# EAGLE design ESP32 led flasher 3 (EAGLE 8.5.1)
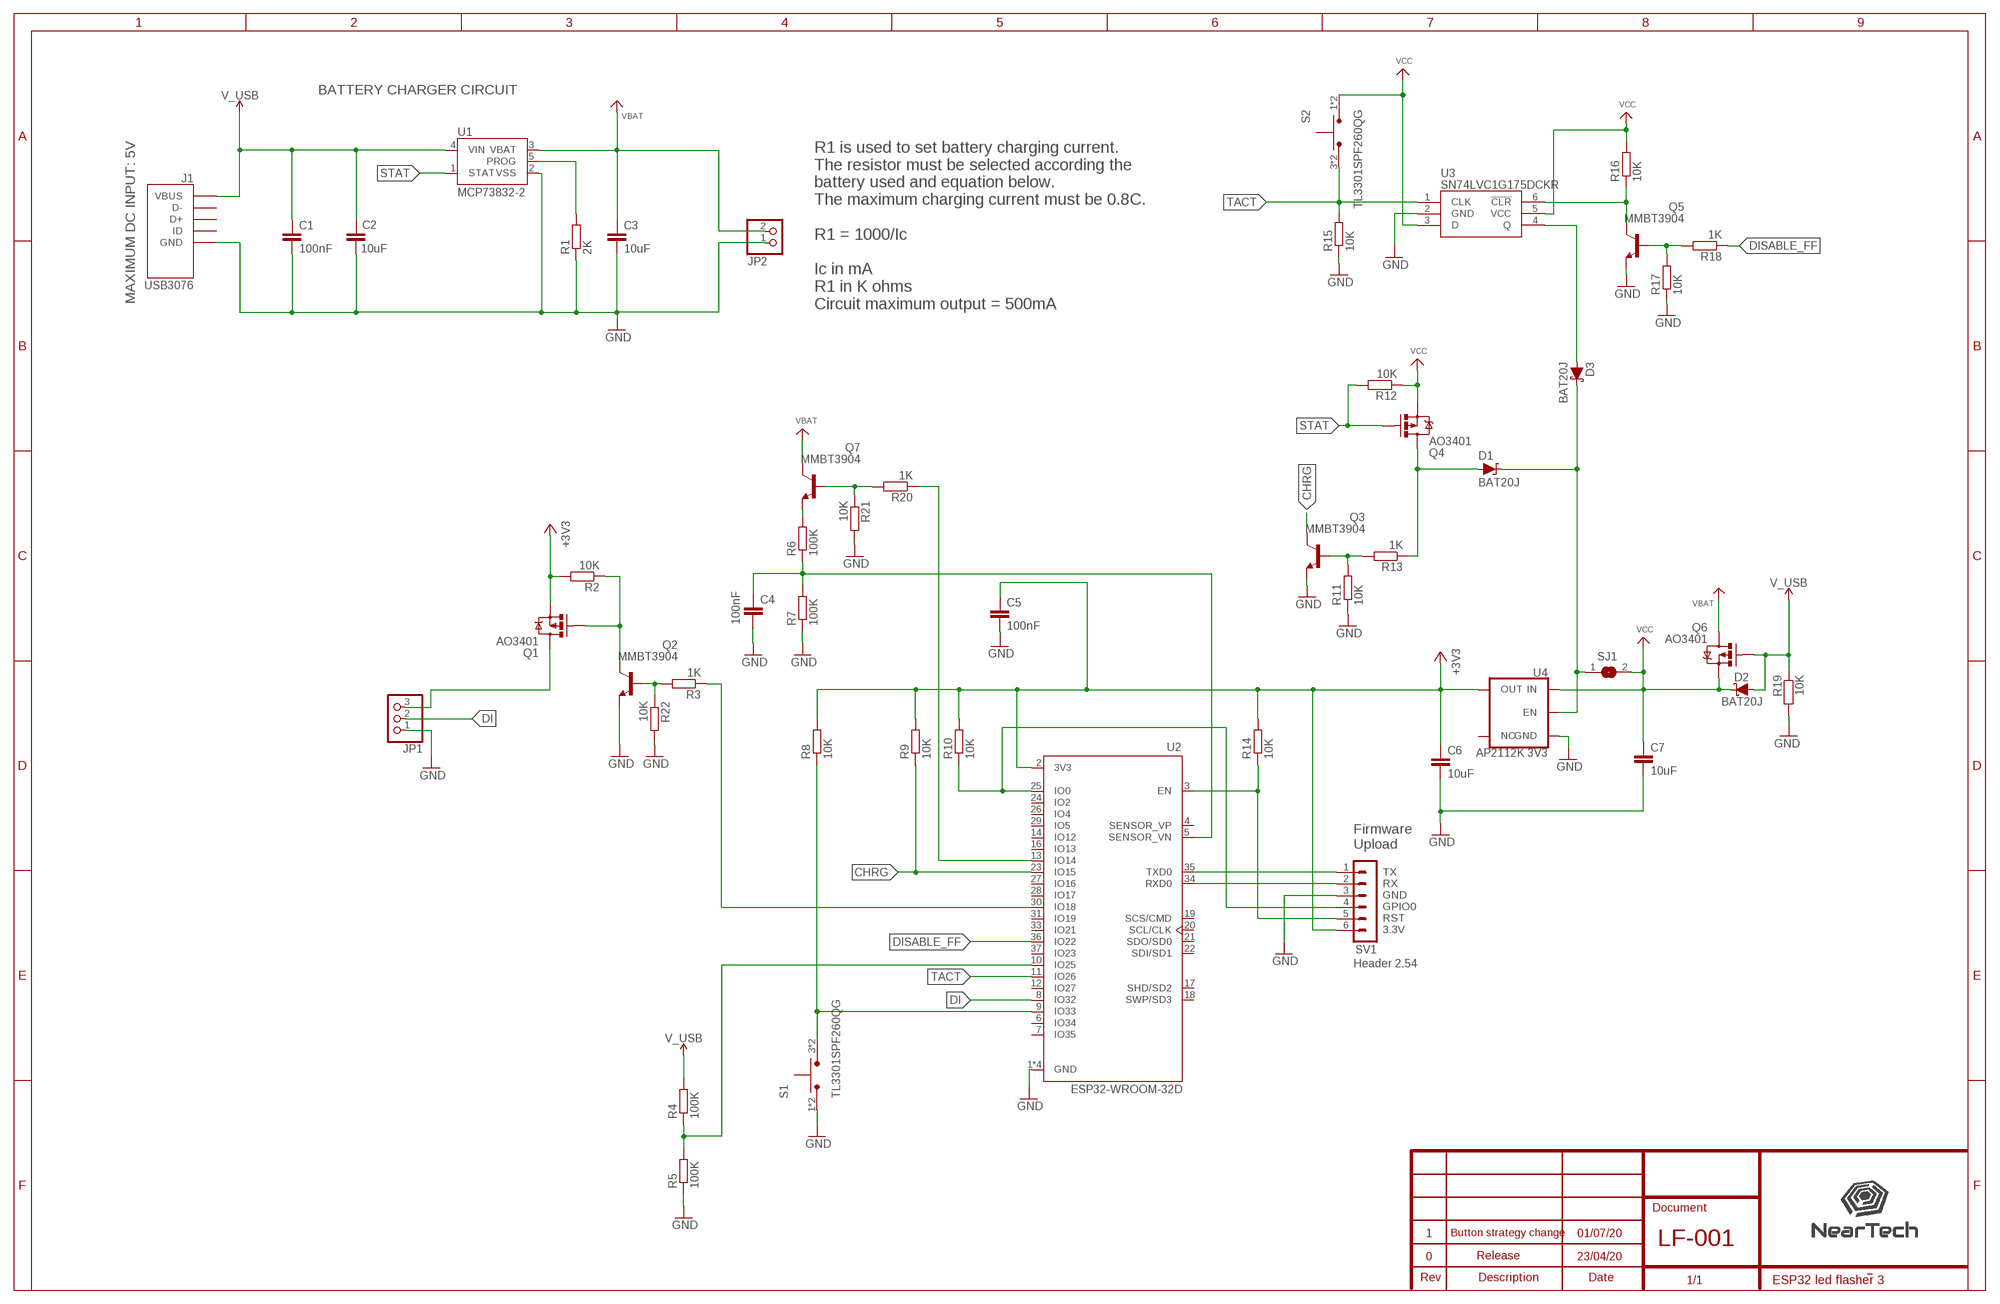
[diagram p0: schematic, sheet 1]

## Parts
C1  100nF  C-EUC0402  [C0402]
C2  10uF  C-EUC0603  [C0603]
C3  10uF  C-EUC0603  [C0603]
C4  100nF  C-EUC0402  [C0402]
C5  100nF  C-EUC0402  [C0402]
C6  10uF  C-EUC0603  [C0603]
C7  10uF  C-EUC0603  [C0603]
D1  BAT20J  DIODE-SCHOTTKY-BAT20J  [SOD-323]
D2  BAT20J  DIODE-SCHOTTKY-BAT20J  [SOD-323]
D3  BAT20J  DIODE-SCHOTTKY-BAT20J  [SOD-323]
J1  USB3076  USB3076-XX-X_REVC  [GCT_USB3076-XX-X_REVC]
JP1  PINHD-1X3_2.54  [1X03]
JP2  PINHD-1X2_2.54  [1X02]
Q1  AO3401  MOSFET-PCHANNELDMG2307L  [SOT23-3@1]
Q2  MMBT3904  BCX70SMD  [SOT23]
Q3  MMBT3904  BCX70SMD  [SOT23]
Q4  AO3401  MOSFET-PCHANNELDMG2307L  [SOT23-3@1]
Q5  MMBT3904  BCX70SMD  [SOT23]
Q6  AO3401  MOSFET-PCHANNELDMG2307L  [SOT23-3@1]
Q7  MMBT3904  BCX70SMD  [SOT23]
R1  2K  R-EU_R0603  [R0603]
R2  10K  R-EU_R0603  [R0603]
R3  1K  R-EU_R0603  [R0603]
R4  100K  R-EU_R0603  [R0603]
R5  100K  R-EU_R0603  [R0603]
R6  100K  R-EU_R0603  [R0603]
R7  100K  R-EU_R0603  [R0603]
R8  10K  R-EU_R0603  [R0603]
R9  10K  R-EU_R0603  [R0603]
R10  10K  R-EU_R0603  [R0603]
R11  10K  R-EU_R0603  [R0603]
R12  10K  R-EU_R0603  [R0603]
R13  1K  R-EU_R0603  [R0603]
R14  10K  R-EU_R0603  [R0603]
R15  10K  R-EU_R0603  [R0603]
R16  10K  R-EU_R0603  [R0603]
R17  10K  R-EU_R0603  [R0603]
R18  1K  R-EU_R0603  [R0603]
R19  10K  R-EU_R0603  [R0603]
R20  1K  R-EU_R0603  [R0603]
R21  10K  R-EU_R0603  [R0603]
R22  10K  R-EU_R0603  [R0603]
S1  TL3301SPF260QG  [SW_TL3301SPF260QG]
S2  TL3301SPF260QG  [SW_TL3301SPF260QG]
SJ1  SOLDERJUMPERREFLOW  [SOLDERJUMPER_REFLOW]
SV1  Header 2.54  MA06-1  [MA06-1]
U1  MCP73832-2  MCP73831  [SOT23-5]
U2  ESP32-WROOM-32D  [MODULE_ESP32-WROOM-32D]
U3  SN74LVC1G175DCKR  [SOP65P210X110-6N]
U4  AP2112K 3V3  V_REG_AP2112K-3.3V  [SOT23-5]

## Nets
!CLR: Q5.3(C) R16.1 U3.6(!CLR)
+3V3: C5.1 C6.1 Q1.2(S) R2.2 R8.2 R9.2 R10.2 R14.2 SV1.6 U2.2(3V3) U4.5(OUT)
CHRG: Q3.3(C) R9.1 U2.23(IO15)
DI: JP1.2 U2.8(IO32)
DISABLE_FF: R18.1 U2.36(IO22)
GND: C1.2 C2.2 C3.2 C4.2 C5.2 C6.2 C7.2 J1.5(GND) JP1.1 JP2.1 Q2.2(E) Q3.2(E) Q5.2(E) R1.1 R5.1 R7.1 R11.1 R15.1 R17.1 R19.2 R21.2 R22.2 S1.1 S1.2 SV1.3 U1.2(VSS) U2.1(GND) U2.15(GND) U2.38(GND) U2.39(GND) U3.2(GND) U4.2(GND)
N$1: D1.A Q4.3(D) R13.1
N$2: Q7.1(B) R20.2 R21.1
N$3: Q3.1(B) R11.2 R13.2
N$4: Q5.1(B) R17.2 R18.2
N$5: Q1.1(G) Q2.3(C) R2.1
N$6: C4.1 R6.1 R7.2 U2.5(SENSOR_VN)
N$8: Q7.2(E) R6.2
N$9: R10.1 SV1.4 U2.25(IO0)
N$10: R14.1 SV1.5 U2.3(EN)
N$11: R1.2 U1.5(PROG)
N$12: SV1.1 U2.35(TXD0)
N$13: SV1.2 U2.34(RXD0)
N$14: R20.1 U2.13(IO14)
N$15: D3.A U3.4(Q)
N$16: Q2.1(B) R3.2 R22.1
N$19: D1.C D3.C SJ1.1 U4.3(EN)
N$21: R8.1 S1.3 S1.4 U2.9(IO33)
N$25: R3.1 U2.30(IO18)
N$26: JP1.3 Q1.3(D)
N$29: R4.1 R5.2 U2.10(IO25)
STAT: Q4.1(G) R12.2 U1.1(STAT)
TACT: R15.2 S2.3 S2.4 U2.11(IO26) U3.1(CLK)
V_USB: C1.1 C2.1 D2.A J1.1(VBUS) Q6.1(G) R4.2 R19.1 U1.4(VIN)
VBAT: C3.1 JP2.2 Q6.3(D) Q7.3(C) U1.3(VBAT)
VCC: C7.1 D2.C Q4.2(S) Q6.2(S) R12.1 R16.2 S2.1 S2.2 SJ1.2 U3.3(D) U3.5(VCC) U4.1(IN)
Unconnected: J1.2(D-) J1.3(D+) J1.4(ID) U2.4(SENSOR_VP) U2.6(IO34) U2.7(IO35) U2.12(IO27) U2.14(IO12) U2.16(IO13) U2.17(SHD/SD2) U2.18(SWP/SD3) U2.19(SCS/CMD) U2.20(SCL/CLK) U2.21(SDO/SD0) U2.22(SDI/SD1) U2.24(IO2) U2.26(IO4) U2.27(IO16) U2.28(IO17) U2.29(IO5) U2.31(IO19) U2.33(IO21) U2.37(IO23) U4.4(NC)

## Notes on the sheet
- BATTERY CHARGER CIRCUIT
- MAXIMUM DC INPUT: 5V
- R1 is used to set battery charging current.
  The resistor must be selected according the 
  battery used and equation below. 
  The maximum charging current must be 0.8C.
  
  R1 = 1000/Ic
  
  Ic in mA
  R1 in K ohms
  Circuit maximum output = 500mA
- Firmware
  Upload
- TX
  RX
  GND
  GPIO0
  RST
  3.3V
- 1 | Button strategy change | 01/07/20
- LF-001
- 0 | Release | 23/04/20

## Library data of the parts
C1 C3-C5 C7 = rcl:C-EU: CAPACITOR, European symbol; SPICEPREFIX: C
C2 C6 = rcl:C-EU: CAPACITOR, European symbol
D1-D3 = SparkFun-DiscreteSemi:DIODE-SCHOTTKY: Schottky diode A Schottky diode is a semiconductor diode which has a low forward voltage drop and a very fast switching action.; PROD_ID: DIO-11623; VALUE: 1A/23V/620mV
J1 = USB3076-XX-X_REVC:USB3076-XX-X_REVC: Micro USB Receptacle, Type B, SMT, Horizontal, Bottom Mount w/out Peg, w/out Shell Stakes, w/out Mating Face Lead-In; AVAILABILITY: Good; DESCRIPTION: USB Series Horizontal Micro USB B Type Bottom Surface Mount Connector; MF: Global Connector Technology; MP: USB3076-30-A; PACKAGE: None; PRICE: 0.38 USD
JP1 = con-pinhead:PINHD-1X3: PIN HEADER
JP2 = con-pinhead:PINHD-1X2: PIN HEADER
Q1 Q4 Q6 = SparkFun-DiscreteSemi:MOSFET-PCHANNEL: Generic PMOSFET IRLML2244 - TRANS-11153 (SOT-23 -20V -4.3A) (1.Gate 2.Source 3.Drain) FQP27P06 - COM-10349 <http://www.sparkfun.com/products/10349> (TO-220 -60V -27A) (1.Gate 2.Source 3.Drain); PROD_ID: TRANS-11308; VALUE: 2.5A/30V
Q2 Q3 Q5 Q7 = transistor:BCX70SMD: NPN TRANSISTOR
R1-R22 = rcl:R-EU_: RESISTOR, European symbol; SPICEPREFIX: R
S1 S2 = TL3301SPF260QG:TL3301SPF260QG: TL3301 Series SPST 2.6 N Round Button Gull Wing Surface Mount Tactile Switch; AVAILABILITY: Unavailable; DESCRIPTION: Tactile Switch SPST-NO Top Actuated Surface Mount; MF: E-Switch; MP: TL3301SPF260QG; PACKAGE: SOT-23 E-Switch; PRICE: None
SJ1 = microbuilder:SOLDERJUMPER: SMD Solder JUMPER Solder the two pads together to create a connection, or remove the solder to break it. REFLOW - Use this footprint for solder paste and reflow ovens. WAVE - Use this footprint for hand-soldering (larger pads). CLOSED - Has a trace between the two pads to ensure it is closed by default. The trace needs to be cut to disable the jumper, and can be closed again by creating a solder bridge between the two pads.
SV1 = con-lstb:MA06-1: PIN HEADER; OC_FARNELL: unknown; OC_NEWARK: unknown
U1 = SparkFun-PowerIC:MCP73831: Miniature single cell, fully integrated Li-Ion, Li-polymer charge management controller http://ww1.microchip.com/downloads/en/DeviceDoc/21984a.pdf IC-09995; PROD_ID: IC-09995
U2 = ESP32-WROOM-32D:ESP32-WROOM-32D: IC: SoC; GPIO, I2C, I2S, IR, SD, SDIO, SPI, UART; 2.7÷3.6VDC; 20dBm; AVAILABILITY: Unavailable; DESCRIPTION: IC: SoC; GPIO, I2C, I2S, IR, SD, SDIO, SPI, UART; 2.7÷3.6VDC; 20dBm; MF: Espressif Systems; MP: ESP32-WROOM-32D; PACKAGE: Module Espressif Systems; PRICE: None
U3 = SN74LVC1G175DCKR:SN74LVC1G175DCKR: Single D-Type Flip-Flop with Asynchronous Clear Source: Datasheet <http://www.ti.com/lit/gpn/sn74lvc1g175>; DESCRIPTION: Single D-Type Flip-Flop with Asynchronous Clear; HEIGHT: 1.1mm; MANUFACTURER_NAME: Texas Instruments; MANUFACTURER_PART_NUMBER: SN74LVC1G175DCKR; MOUSER_PART_NUMBER: 595-SN74LVC1G175DCKR; MOUSER_PRICE-STOCK: https://www.mouser.com/Search/Refine.aspx?Keyword=595-SN74LVC1G175DCKR; RS_PART_NUMBER: 595-SN74LVC1G175DCKR; RS_PRICE-STOCK: https://www.mouser.com/Search/Refine.aspx?Keyword=595-SN74LVC1G175DCKR
U4 = SparkFun-IC-Power:V_REG_AP2112: AP2112 - 600mA CMOS LDO Regulator w/ Enable The AP2112 is CMOS process low dropout linear regulator with enable function, the regulator delivers a guaranteed 600mA (min.) continuous load current. Features Output Voltage Accuracy: ±1.5% Output Current: 600mA (Min.) Foldback Short Current Protection: 50mA Enable Function to Turn ON/OFF VOUT Low Dropout Voltage (3.3V): 250mV (Typ.) @IOUT=600mA Excellent Load Regulation: 0.2%/A (Typ.) Excellent Line Regulation: 0.02%/V (Typ.) Low Quiescent Current: 55μA (Typ.) Low Standby Current: 0.01μA (Typ.) Low Output Noise: 50μVRMS PSRR: 100Hz -65dB, 1kHz -65dB OTSD Protection Stable with 1.0μF Flexible Cap: Ceramic, Tantalum and Aluminum Electrolytic Operation Temperature Range: -40°C to 85°C ESD: MM 400V, HBM 4000V; PROD_ID: VREG-12457; VALUE: 3.3V

## Net classes
0 default: width 0 mm, drill 0 mm
1 vcc: width 0 mm

## Board
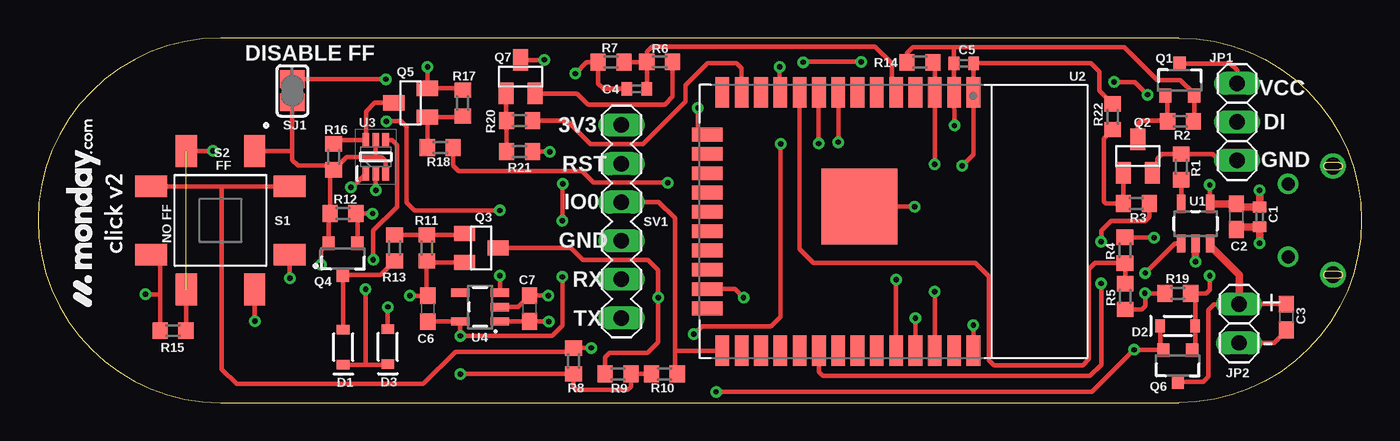
[diagram p1: board, top side]
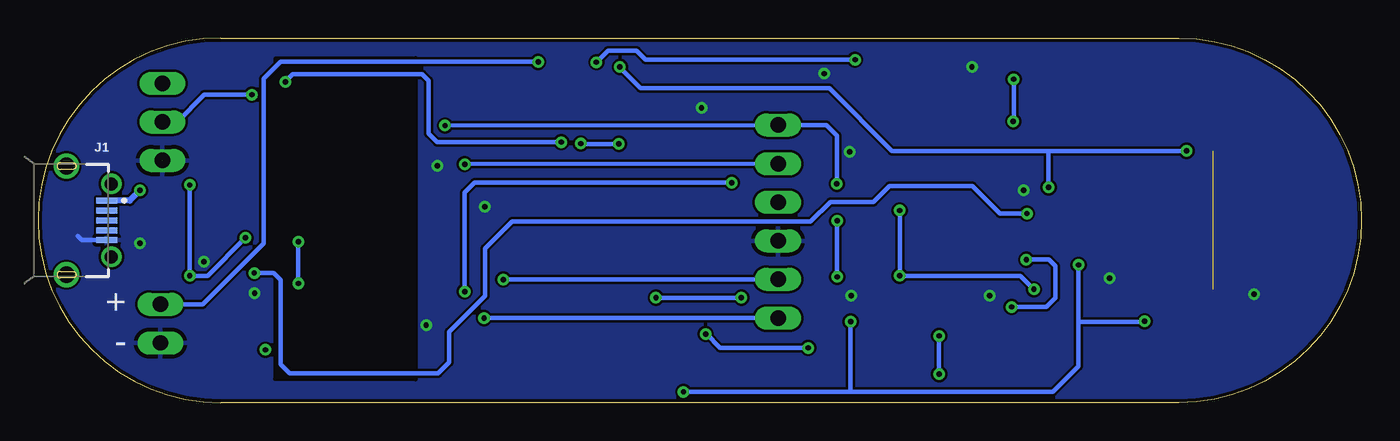
[diagram p2: board, bottom side, seen from below]

Size 87.03 x 24 mm. Coordinates in mm from the lower left corner, seen from the top.
Outline: 12,0 75,0 arc180 75,24 12,24 arc180 12,0
Copper layers (1*16): Top 0.035mm / dielectric 1.5mm / Bottom 0.035mm
Design rules "default *": minimum track width 6mil, minimum drill 0.35mm, track to track 6mil, track to pad 6mil, pad to pad 6mil, via to via 6mil, smd to smd 6mil, copper to edge 10mil, drill to drill 6mil, minimum pad ring 10mil, minimum via ring 8mil, stop-mask expansion 4mil, vias tented up to drill 15mil, thermal gap 10mil

### Footprints (pad centres in the part's own frame; a part is rotated, then mirrored left to right if it is on the bottom)
C0402 = smd 0.7 x 0.9: 1 -0.65,0; 2 0.65,0
C0603 = smd 1.1 x 1: 1 -0.85,0; 2 0.85,0
SOD-323 = smd 0.63 x 0.83: A 1.15,0; C -1.15,0
GCT_USB3076-XX-X_REVC = smd 0.4 x 1.4: 1 -1.3,2.65; 2 -0.65,2.65; 3 0,2.65; 4 0.66,2.65; 5 1.3,2.65 | drill 1.1: P$1 -3.575,0; P$2 3.575,0 | drill 0.85: P$3 -2.4,2.95; P$4 2.4,2.95
1X03 = drill 1.016 long: 1 -2.54,0; 2 0,0; 3 2.54,0
1X02 = drill 1.016 long: 1 -1.27,0; 2 1.27,0
SOT23-3@1 = smd 0.8 x 0.9: 1 -0.95,-1; 2 0.95,-1; 3 0,1.1
SOT23 = smd 1 x 1.4: 1 -0.95,-1.1; 2 0.95,-1.1; 3 0,1.1
R0603 = smd 1 x 1.1: 1 -0.85,0; 2 0.85,0
SW_TL3301SPF260QG = smd 2.1 x 1.4: 1 -4.55,2.25; 2 4.55,2.25; 3 -4.55,-2.25; 4 4.55,-2.25
SOLDERJUMPER_REFLOW = smd 1.168 x 1.6: 1 -0.762,0; 2 0.762,0
MA06-1 = drill 1.016 long: 1 -6.35,0; 2 -3.81,0; 3 -1.27,0; 4 1.27,0; 5 3.81,0; 6 6.35,0
SOT23-5 = smd 0.55 x 1.2: 1 -0.95,-1.3; 2 0,-1.3; 3 0.95,-1.3; 4 0.95,1.3; 5 -0.95,1.3
MODULE_ESP32-WROOM-32D = smd 2 x 0.9: 1 -8.5,5.26; 2 -8.5,3.99; 3 -8.5,2.72; 4 -8.5,1.45; 5 -8.5,0.18; 6 -8.5,-1.09; 7 -8.5,-2.36; 8 -8.5,-3.63; 9 -8.5,-4.9; 10 -8.5,-6.17; 11 -8.5,-7.44; 12 -8.5,-8.71; 13 -8.5,-9.98; 14 -8.5,-11.25; 25 8.5,-11.25; 26 8.5,-9.98; 27 8.5,-8.71; 28 8.5,-7.44; 29 8.5,-6.17; 30 8.5,-4.9; 31 8.5,-3.63; 32 8.5,-2.36; 33 8.5,-1.09; 34 8.5,0.18; 35 8.5,1.45; 36 8.5,2.72; 37 8.5,3.99; 38 8.5,5.26 | smd 0.9 x 2: 15 -5.715,-12.25; 16 -4.445,-12.25; 17 -3.175,-12.25; 18 -1.905,-12.25; 19 -0.635,-12.25; 20 0.635,-12.25; 21 1.905,-12.25; 22 3.175,-12.25; 23 4.445,-12.25; 24 5.715,-12.25 | smd 5 x 5: 39 -1,-2.24
SOP65P210X110-6N = smd 0.95 x 0.45: 1 -1.1,0.65; 2 -1.1,0; 3 -1.1,-0.65; 4 1.1,-0.65; 5 1.1,0; 6 1.1,0.65

### Placement (x,y rotation side)
C1  80.33,12.23 270 top
C2  78.79,12.24 270 top
C3  82.08,5.64 270 top
C4  39.37,20.65 180 top
C5  60.88,22.33 0 top
C6  25.64,6.19 90 top
C7  32.32,6.2 90 top
D1  20.06,3.66 90 top
D2  74.94,5.05 0 top
D3  23,3.68 90 top
J1  85.15,12 270 bottom
JP1  78.85,18.48 90 top
JP2  78.98,5.21 90 top
Q1  75.07,21.21 0 top
Q2  72.33,16.23 0 top
Q3  29.14,10.19 270 top
Q4  20.05,9.5 180 top
Q5  24.5,19.74 90 top
Q6  74.94,2.46 180 top
Q7  31.74,21.45 0 top
R1  75.17,15.52 270 top
R2  75.12,18.52 0 top
R3  72.22,13.11 180 top
R4  71.46,10.03 90 top
R5  71.49,6.99 90 top
R6  40.88,22.43 0 top
R7  37.68,22.4 0 top
R8  35.22,2.74 270 top
R9  38.14,1.91 0 top
R10  41.18,1.91 180 top
R11  25.56,10.19 90 top
R12  20.05,12.45 0 top
R13  23.46,10.19 90 top
R14  57.99,22.4 180 top
R15  8.88,4.74 0 top
R16  19.44,16.18 270 top
R17  27.93,19.71 270 top
R18  26.45,16.79 180 top
R19  74.94,7.19 180 top
R20  31.66,18.56 180 top
R21  31.66,16.52 0 top
R22  70.66,18.81 90 top
S1  12,11.99 180 top
S2  12,12 270 top
SJ1  16.72,20.52 270 top
SV1  38.37,11.92 90 top
U1  76.11,11.79 0 top
U2  56.25,11.92 270 top
U3  22.21,16.18 90 top
U4  29.07,6.3 90 top

### Tracks (layer width: path | path; a pad name or v marks a point on that pad's centre or on a via)
!CLR
  Top 0.305: Q5.3 22.13,19.74 21.56,19.16 U3.6 19.69,17.28 R16.1
+3V3  (via drill 0.35)
  Top 0.305: v60.26,18.24 U2.2 60.23,20.43 C5.1 60.23,23.34 60.28,23.39 | 60.28,23.39 71.44,23.39 73.59,21.23 75.12,21.23 76.02,20.34 Q1.2 76.02,18.57 R2.2 | R10.2 R9.2 38.99,1.05 38.77,0.84 35.42,0.84 35.22,1.04 R8.2 27.79,1.89 v27.77,1.88 | C6.1 27.76,5.34 | 27.76,5.34 U4.5 | 27.76,5.34 27.76,4.41 v27.77,4.39 33.79,4.39 34.48,5.08 v34.48,8.28 | v34.48,11.96 v34.5,14.4 | 60.28,23.39 57.52,23.39 57.14,23.02 R14.2
  Bottom 0.305: SV1.6 38.75,18.27 | 38.75,18.27 v60.26,18.24 | v27.77,1.88 v27.77,4.39 | v34.48,8.28 v34.48,11.96 | v34.5,14.4 34.48,17.58 35.17,18.27 38.75,18.27
CHRG  (via drill 0.35)
  Top 0.305: v46.39,6.91 45.82,7.48 U2.23 | Q3.3 35.06,10.19 35.85,9.4 40.12,9.4 40.78,8.74 v40.78,6.91 40.78,3.96 40.09,3.28 37.58,3.28 37.29,2.98 R9.1
  Bottom 0.305: v40.78,6.91 v46.39,6.91
DI  (via drill 0.35)
  Top 0.305: U2.8 v52.62,17.15 v52.62,17.14 | v72.96,20.27 72.12,21.11 v70.77,21.11
  Bottom 0.305: v52.62,17.14 60.79,17.14 61.35,17.7 61.35,21.18 61.78,21.61 70.27,21.61 70.85,21.03 v70.77,21.11 | v72.96,20.27 76.08,20.27 77.88,18.48 JP1.2
DISABLE_FF  (via drill 0.35)
  Top 0.305: U2.36 v58.97,7.31 v58.97,7.32 | v41.41,14.48 36.54,14.48 35.76,15.26 27.66,15.26 27.3,15.61 R18.1
  Bottom 0.305: v58.97,7.32 58.97,13.84 58.33,14.48 v41.41,14.48
GND  (via drill 0.35)  (1 unrouted)
  Top 0.305: JP2.1 81.29,3.94 82.08,4.72 C3.2 | 78.97,11.58 C2.2 | U2.38 v61.51,5.1 v61.51,5.11 | R19.2 72.81,7.19 | 72.81,7.19 v72.78,7.21 | Q2.2 73.28,15.48 73.44,15.65 73.59,15.65 73.59,16.05 73.9,16.36 75.16,16.36 R1.1 77.27,16.37 77.7,15.94 JP1.1 | U4.2 31.56,6.3 32.31,7.05 C7.2 v33.55,7.05 v33.56,7.04 | C6.2 25.59,7.04 | 25.59,7.04 v24.45,7.04 | Q3.2 25.66,9.23 R11.1 25.56,7.06 25.59,7.04 | C4.2 37.17,20.65 36.83,20.99 R7.1 36.08,22.4 v35.34,21.66 | U2.39 57.62,12.92 v57.64,12.9 | R17.1 27.8,20.69 Q5.2 25.61,20.7 v25.61,22.1 | U3.2 v22.21,13.97 | R5.1 72.57,6.13 72.81,6.38 72.81,7.19 | U2.15 43.86,17.78 43.39,17.78 v43.39,19.41 | v60.77,15.6 61.51,16.33 U2.1 61.51,22.3 C5.2 69.23,22.33 69.78,21.77 69.78,20.54 R22.2 | 8.03,7.13 8.03,9.16 S1.2 | 8.03,7.13 R15.1 | S1.1 16.55,8.21 v16.57,8.19 | 8.03,7.13 v7.06,7.13 | R21.2 33.63,16.52 v33.65,16.5
  Top 0.508: 78.97,11.58 C1.2 v80.33,10.49 | U1.2 v76.11,9.27
  Bottom 0.305: 84.42,10.97 84.14,10.7 J1.5 | v22.21,13.97 22.24,13.99 | v25.61,22.1 25.61,22.07 | v7.06,7.13 v7.06,7.14
  pour Bottom: -1.69,-1.73 88.53,-1.73 88.63,-1.63 88.63,24.05 88.78,24.21 -1.67,24.21 -1.69,24.23
N$1
  Top 0.305: R13.1 22.52,8.4 Q4.3 D1.A
N$2
  Top 0.305: Q7.1 30.79,18.59 R20.2 R21.1
N$3
  Top 0.305: R13.2 R11.2 27.95,11.04 Q3.1
N$4
  Top 0.305: R18.2 Q5.1 27.85,18.79 R17.2
N$5
  Top 0.305: R2.1 74.27,18.54 | 74.27,18.54 74.27,20.06 Q1.1 | Q2.3 72.33,18.36 72.53,18.57 74.24,18.57 74.27,18.54
N$6
  Top 0.305: C4.1 R6.1 | R6.1 40,22.4 R7.2 | R6.1 40.03,23.08 40.38,23.44 55.04,23.44 56.13,22.34 56.13,20.72 U2.5
N$7
  cutout Bottom (rank 2, no thermals): 71.39,22.63 71.41,22.61 71.41,1.6 71.44,1.57 62.22,1.57 62.19,1.55 62.19,22.66
N$8
  Top 0.305: Q7.2 35.43,20.35 36.16,19.63 41.22,19.63 41.73,20.14 R6.2
N$9
  Top 0.305: SV1.4 40.8,13.21 41.87,12.14 41.87,3.38 | 41.87,3.38 41.87,2.07 R10.1 | U2.25 41.92,3.42 41.87,3.38
N$10  (via drill 0.35)
  Top 0.305: v58.97,15.7 U2.3 58.97,22.21 R14.1
  Bottom 0.305: SV1.5 v58.97,15.7
N$11
  Top 0.305: U1.5 R1.2
N$12  (via drill 0.35)
  Top 0.305: v57.7,5.56 U2.35
  Bottom 0.305: SV1.1 57.68,5.57 v57.7,5.56
N$13  (via drill 0.35)
  Top 0.305: v56.42,8.1 U2.34
  Bottom 0.305: SV1.2 56.41,8.11 v56.42,8.1
N$14
  Top 0.305: R20.1 34.8,18.56 36.35,17.02 39.77,17.02 42.57,19.81 42.57,20.91 44.02,22.36 45.94,22.36 46.27,22.03 U2.13
N$15  (via drill 0.35)
  Top 0.305: U3.4 23.29,17.28 23.61,16.96 23.61,12.89 22.04,11.32 v22.04,9.41 | v23,6.3 D3.A
  Bottom 0.305: v23,6.3 20.72,6.3 20.14,6.88 20.14,9.01 20.54,9.41 v22.04,9.41
N$16
  Top 0.305: Q2.1 R3.2 | R3.2 | R22.1 70.09,17.39 70.09,13.25 70.23,13.11 R3.2
N$19  (via drill 0.35)
  Top 0.305: SJ1.1 v22.87,21.29 | v30.36,12.65 24.75,12.65 24.24,13.16 24.24,18.16 23.89,18.52 v22.9,18.52 | v30.36,8.36 v30.37,8.35 U4.3 | D1.C 21.54,2.51 | 21.54,2.51 22.98,2.51 D3.C | 21.54,2.51 v21.54,7.46
  Bottom 0.305: v22.87,21.29 22.87,18.54 v22.9,18.52 | v30.36,12.65 v30.36,8.36 22.44,8.36 v21.54,7.46
N$21  (via drill 0.35)
  Top 0.305: v36.38,3.61 35.23,3.61 R8.1 34.98,3.36 27.46,3.36 25.33,1.23 13.06,1.23 12.08,2.21 12.08,14.24 | S1.3 12.08,14.24 | 12.08,14.24 S1.4 | v43.13,4.52 43.65,5.04 48.21,5.04 48.83,5.65 v48.83,17.03 | v51.33,17.05 51.33,20.41 U2.9
  Bottom 0.305: v36.38,3.61 42.17,3.61 43.08,4.52 v43.13,4.52 | v48.83,17.03 51.31,17.03 v51.33,17.05
N$25  (via drill 0.35)
  Top 0.305: U2.30 51.35,2.04 51.63,1.75 69.18,1.75 69.91,2.48 v69.91,7.85 | R3.1 73.07,12.23 72.81,11.96 70.55,11.96 69.91,11.33 v69.91,10.59
  Bottom 0.305: v69.91,10.59 v69.91,7.85
N$26
  Top 0.305: Q1.3 78.41,22.31 78.85,21.87 JP1.3
N$29
  Top 0.305: R5.2 71.49,9.16 R4.1 69.49,9.18 69.1,8.79 69.1,2.87 68.69,2.46 62.85,2.46 62.52,2.79 62.52,8.31 61.64,9.18 51,9.18 50.08,10.11 U2.10
STAT  (via drill 0.35)
  Top 0.305: Q4.1 21,12.35 R12.2 v22,12.45 | v72.81,8.53 74.76,10.49 U1.1
  Bottom 0.305: v22,12.45 23.77,12.45 25.57,14.25 31.04,14.25 32.08,13.21 34.93,13.21 36.23,11.91 55.87,11.91 57.64,10.13 57.64,7.01 60.01,4.65 60.01,2.64 60.72,1.93 70.46,1.93 71.07,2.54 71.07,8.08 71.53,8.53 v72.81,8.53
TACT  (via drill 0.35)  (1 unrouted)
  Top 0.305: S2.4 9.75,4.76 R15.2 | S2.3 11.48,16.55 v11.51,16.57 | v48.77,22.1 48.77,20.46 U2.11 | U3.1 20.65,14.17 v20.57,14.17
  Bottom 0.305: v11.51,16.57 20.57,16.57 | 20.57,16.57 30.86,16.57 34.97,20.69 47.4,20.69 48.77,22.06 v48.77,22.1 | v20.57,14.17 20.57,16.57
V_USB  (via drill 0.35)
  Top 0.305: C2.1 79,12.88 | Q6.1 76.09,3.66 D2.A 76.09,6.89 R19.1 76.82,7.19 77.05,7.42 v77.05,8.36 | U1.4 77.06,14.31 v77.05,14.33 | R4.2 73.35,10.88 v73.39,10.85
  Top 0.508: U1.4 C2.1 | 79,12.88 C1.1 v80.33,13.97
  Bottom 0.305: v77.05,14.33 v77.05,8.36 75.88,8.36 v73.39,10.85
  Bottom 0.406: v80.33,13.97 81,13.3 J1.1
VBAT  (via drill 0.35)
  Top 0.305: C3.1 78.99,6.49 JP2.2 77.3,6.48 76.95,6.12 76.95,1.7 76.61,1.36 Q6.3 | 77.28,10.03 77.06,10.25 U1.3 | Q7.3 33.28,22.55 v33.3,22.57 | v54.14,22.43 50.33,22.43 v50.31,22.4
  Top 0.508: JP2.2 78.98,8.41 77.14,10.25 77.06,10.25
  Bottom 0.305: v54.14,22.43 71.06,22.43 72.17,21.31 72.17,10.49 76.19,6.48 JP2.2 | v33.3,22.57 47.08,22.57 47.68,23.17 49.54,23.17 v50.31,22.4
VCC  (via drill 0.35)
  Top 0.305: D2.C 73.79,3.66 Q6.2 73.97,3.48 v72.07,3.48 69.3,0.71 v44.58,0.71 | U4.1 C7.1 33.58,5.35 v33.59,5.33 | v18.6,9.07 18.6,10 Q4.2 19.1,12.35 R12.1 19.2,15.09 19.33,15.22 | 19.33,15.22 R16.2 20.29,16.18 22.16,16.18 | U3.3 22.86,15.91 22.59,16.18 22.16,16.18 | U3.5 22.21,16.23 22.16,16.18 | SJ1.2 16.72,16.57 | 16.72,16.57 16.72,15.98 17.11,15.6 18.96,15.6 19.33,15.22 | S2.2 v14.25,5.37 v14.26,5.36 | S2.1 16.7,16.55 16.72,16.57
  Bottom 0.305: v44.58,0.71 33.56,0.71 | 33.56,0.71 20.28,0.71 18.6,2.39 18.6,5.36 | v14.26,5.36 14.29,5.33 18.58,5.33 18.6,5.36 | v18.6,9.07 18.6,5.36 | 33.56,0.71 33.59,0.74 v33.59,5.33

### Text on the board
tPlace: DISABLE FF | VCC | 3V3 | DI | FF | RST | GND | NO FF | IO0 | GND | RX | + | TX | -
bPlace: + | -